# EAGLE design LEDStrip (EAGLE 7.4.0)
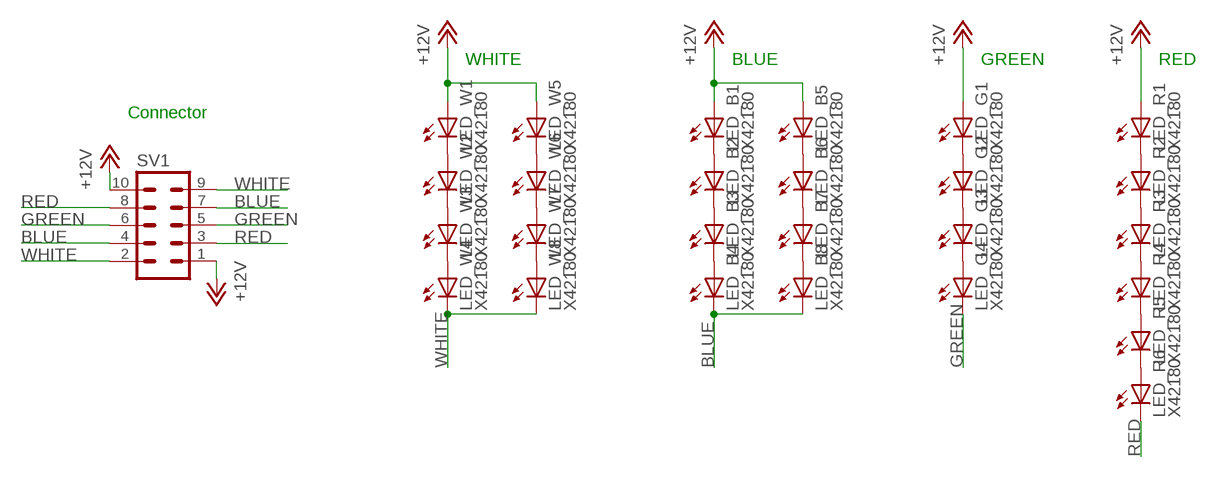
[diagram p0: schematic, sheet 1]

## Parts
LED_B1  X42180  [Z-POWER-LED-DOME-TYPE]
LED_B2  X42180  [Z-POWER-LED-DOME-TYPE]
LED_B3  X42180  [Z-POWER-LED-DOME-TYPE]
LED_B4  X42180  [Z-POWER-LED-DOME-TYPE]
LED_B5  X42180  [Z-POWER-LED-DOME-TYPE]
LED_B6  X42180  [Z-POWER-LED-DOME-TYPE]
LED_B7  X42180  [Z-POWER-LED-DOME-TYPE]
LED_B8  X42180  [Z-POWER-LED-DOME-TYPE]
LED_G1  X42180  [Z-POWER-LED-DOME-TYPE]
LED_G2  X42180  [Z-POWER-LED-DOME-TYPE]
LED_G3  X42180  [Z-POWER-LED-DOME-TYPE]
LED_G4  X42180  [Z-POWER-LED-DOME-TYPE]
LED_R1  X42180  [Z-POWER-LED-DOME-TYPE]
LED_R2  X42180  [Z-POWER-LED-DOME-TYPE]
LED_R3  X42180  [Z-POWER-LED-DOME-TYPE]
LED_R4  X42180  [Z-POWER-LED-DOME-TYPE]
LED_R5  X42180  [Z-POWER-LED-DOME-TYPE]
LED_R6  X42180  [Z-POWER-LED-DOME-TYPE]
LED_W1  X42180  [Z-POWER-LED-DOME-TYPE]
LED_W2  X42180  [Z-POWER-LED-DOME-TYPE]
LED_W3  X42180  [Z-POWER-LED-DOME-TYPE]
LED_W4  X42180  [Z-POWER-LED-DOME-TYPE]
LED_W5  X42180  [Z-POWER-LED-DOME-TYPE]
LED_W6  X42180  [Z-POWER-LED-DOME-TYPE]
LED_W7  X42180  [Z-POWER-LED-DOME-TYPE]
LED_W8  X42180  [Z-POWER-LED-DOME-TYPE]
SV1  MA05-2  [MA05-2]

## Nets
+12V: LED_B1.A LED_B5.A LED_G1.A LED_R1.A LED_W1.A LED_W5.A SV1.1 SV1.10
BLUE: LED_B4.C LED_B8.C SV1.4 SV1.7
GREEN: LED_G4.C SV1.5 SV1.6
N$1: LED_W1.C LED_W2.A
N$2: LED_W2.C LED_W3.A
N$3: LED_W3.C LED_W4.A
N$4: LED_W5.C LED_W6.A
N$5: LED_W6.C LED_W7.A
N$6: LED_W7.C LED_W8.A
N$7: LED_R4.C LED_R5.A
N$8: LED_B1.C LED_B2.A
N$9: LED_B2.C LED_B3.A
N$10: LED_B3.C LED_B4.A
N$11: LED_B5.C LED_B6.A
N$12: LED_B6.C LED_B7.A
N$13: LED_B7.C LED_B8.A
N$14: LED_G1.C LED_G2.A
N$15: LED_G2.C LED_G3.A
N$16: LED_G3.C LED_G4.A
N$20: LED_R1.C LED_R2.A
N$21: LED_R2.C LED_R3.A
N$22: LED_R3.C LED_R4.A
N$25: LED_R5.C LED_R6.A
RED: LED_R6.C SV1.3 SV1.8
WHITE: LED_W4.C LED_W8.C SV1.2 SV1.9

## Notes on the sheet
- WHITE | BLUE | GREEN | RED
- Connector

## Library data of the parts
LED_B1-LED_B8 LED_G1-LED_G4 LED_R1-LED_R6 LED_W1-LED_W8 = logan-custom:X42180: Z-Power LED P4 Series, Dome type Source: http://www.seoulsemicon.co.kr .. X42180.pdf
SV1 = con-lstb:MA05-2: PIN HEADER; OC_FARNELL: unknown; OC_NEWARK: unknown

## Board
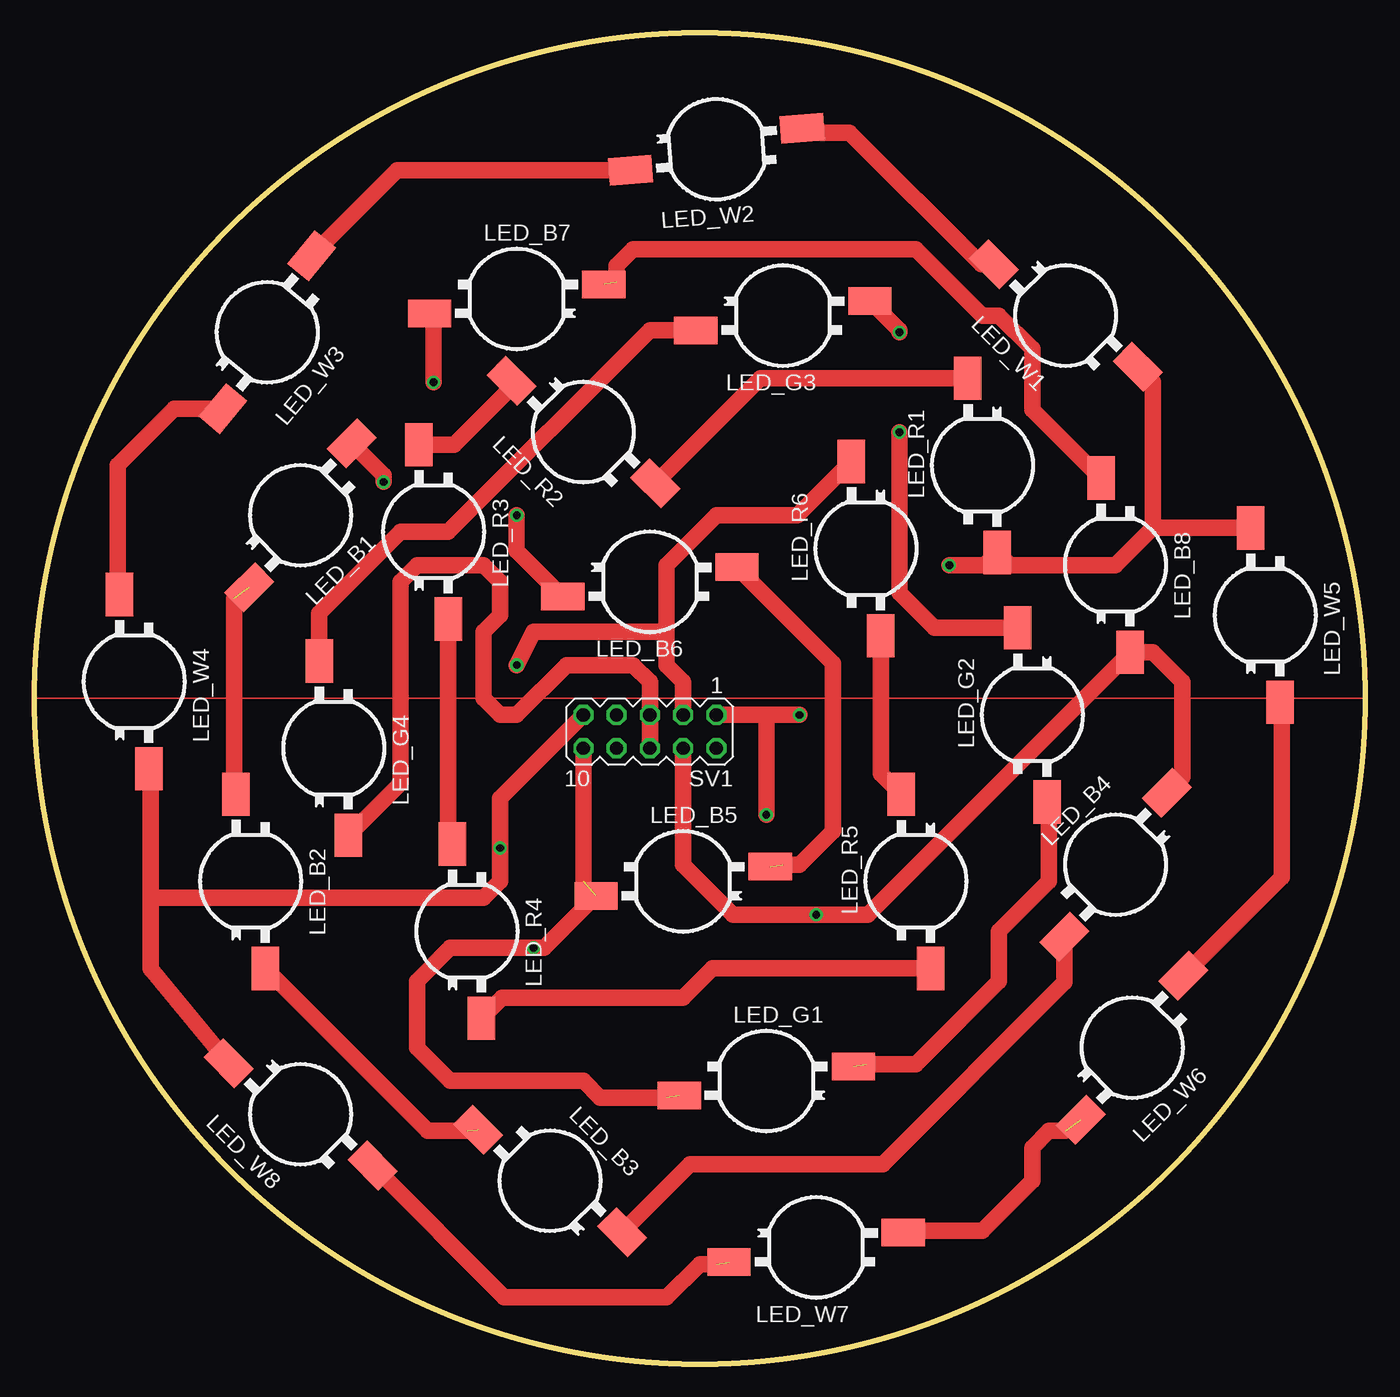
[diagram p1: board, top side]
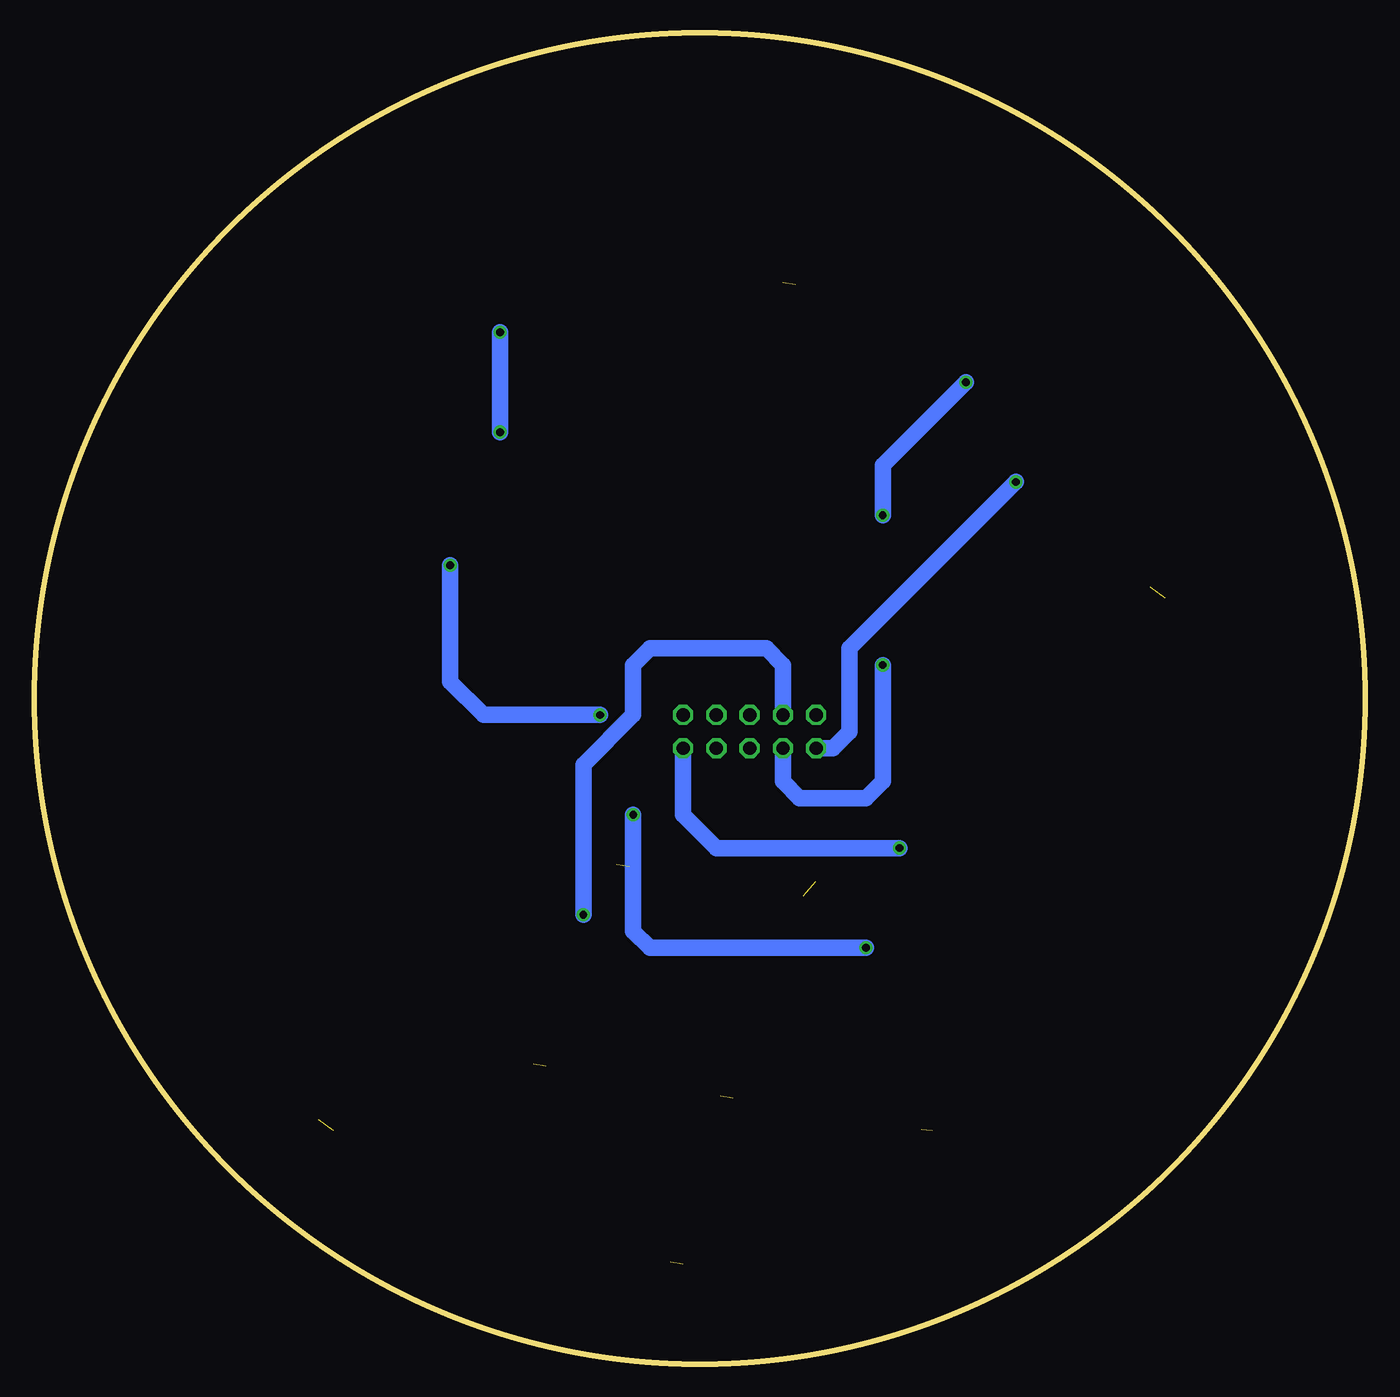
[diagram p2: board, bottom side, seen from below]

Size 101.6 x 101.6 mm. Coordinates in mm from the lower left corner, seen from the top.
Outline: circle at 50.8,50.8 radius 50.8
Copper layers (1*16): Top 0.035mm / dielectric 1.5mm / Bottom 0.035mm
Design rules "default": minimum track width 10mil, minimum drill 24mil, track to track 8mil, track to pad 8mil, pad to pad 8mil, via to via 8mil, smd to smd 8mil, copper to edge 40mil, drill to drill 8mil, minimum pad ring 10mil, minimum via ring 8mil, stop-mask expansion 4mil, vias tented up to drill 0mil, thermal gap 10mil

### Footprints (pad centres in the part's own frame; a part is rotated, then mirrored left to right if it is on the bottom)
Z-POWER-LED-DOME-TYPE = smd 3.3 x 2.1: A -6.65,-1.12; C 6.65,1.12
MA05-2 = drill 1.016 octagon: 1 -5.08,-1.27; 2 -5.08,1.27; 3 -2.54,-1.27; 4 -2.54,1.27; 5 0,-1.27; 6 0,1.27; 7 2.54,-1.27; 8 2.54,1.27; 9 5.08,-1.27; 10 5.08,1.27

### Placement (x,y rotation side)
LED_B1  20.32,64.77 225 top
LED_B2  16.51,36.83 270 top
LED_B3  39.37,13.97 315 top
LED_B4  82.55,38.1 45 top
LED_B5  49.53,36.83 0 top
LED_B6  46.99,59.69 180 top
LED_B7  36.83,81.28 0 top
LED_B8  82.55,60.96 270 top
LED_G1  55.88,21.59 0 top
LED_G2  76.2,49.53 90 top
LED_G3  57.15,80.01 180 top
LED_G4  22.86,46.99 270 top
LED_R1  72.39,68.58 90 top
LED_R2  41.91,71.12 135 top
LED_R3  30.48,63.5 270 top
LED_R4  33.02,33.02 270 top
LED_R5  67.31,36.83 90 top
LED_R6  63.5,62.23 90 top
LED_W1  78.74,80.01 135 top
LED_W2  52.07,92.71 184.2 top
LED_W3  17.78,78.74 230.3 top
LED_W4  7.62,52.07 270 top
LED_W5  93.98,57.15 270 top
LED_W6  83.82,24.13 225 top
LED_W7  59.69,8.89 180 top
LED_W8  20.32,19.05 135 top
SV1  46.99,48.26 180 top

### Tracks (layer width: path | path; a pad name or v marks a point on that pad's centre or on a via)
+12V  (via drill 0.6)  (2 unrouted)
  Top 1.27: LED_B5.A 38.92,31.75 v38.1,31.75 31.75,31.75 29.21,29.21 29.21,24.13 31.75,21.59 41.91,21.59 43.18,20.32 48.26,20.32 | 85.39,63.8 82.55,60.96 74.48,60.96 LED_R1.A 72.54,60.96 v69.85,60.96 | 85.39,63.8 LED_W5.A | LED_W1.A 85.39,74.94 85.39,63.8 | LED_B1.A 26.67,67.83 v26.67,67.31 | SV1.10 41.91,36.83 | 55.88,49.53 v58.42,49.53 | SV1.1 55.88,49.53 | 55.88,49.53 v55.88,41.91
  Bottom 1.27: v26.67,67.31 39.37,54.61 39.37,48.26 40.64,46.99 SV1.10 | v69.85,60.96 69.85,52.07 67.31,49.53 v58.42,49.53 | v55.88,41.91 55.88,33.02 54.61,31.75 v38.1,31.75
BLUE  (via drill 0.6)
  Top 1.27: LED_B4.C 87.63,44.76 87.63,52.07 85.39,54.31 LED_B8.C 63.65,34.29 v59.69,34.29 53.34,34.29 49.53,38.1 SV1.4
  Bottom 1.27: SV1.7 44.45,53.34 45.72,54.61 54.61,54.61 55.88,53.34 55.88,49.53 59.69,45.72 v59.69,34.29
GREEN
  Top 1.27: LED_G4.C 27.94,44.3 27.94,59.69 29.21,60.96 34.29,60.96 35.56,59.69 35.56,57.15 34.29,55.88 34.29,50.8 35.56,49.53 36.83,49.53 40.64,53.34 45.72,53.34 46.99,52.07 SV1.5 SV1.6
N$1
  Top 1.27: LED_W2.A 58.42,94.11 58.42,93.98 62.23,93.98 72.29,83.92 LED_W1.C
N$2
  Top 1.27: LED_W3.A 27.7,91.11 LED_W2.C
N$3
  Top 1.27: LED_W4.A 6.35,58.87 6.35,68.58 10.68,72.91 LED_W3.C
N$4
  Top 1.27: LED_W6.A 95.25,37.14 95.25,49.53 95.1,49.68 LED_W5.C
N$5  (1 unrouted)
  Top 1.27: LED_W7.A 66.49,10.16 72.39,10.16 76.2,13.97 76.2,16.51 77.47,17.78 78.74,17.78
N$6  (1 unrouted)
  Top 1.27: LED_W8.A 35.87,5.08 48.26,5.08 50.8,7.62 52.07,7.62
N$7
  Top 1.27: LED_R4.C 35.71,27.94 49.53,27.94 51.77,30.18 LED_R5.A
N$8  (1 unrouted)
  Top 1.27: LED_B2.A 15.24,43.63 15.24,58.42
N$9  (1 unrouted)
  Top 1.27: LED_B2.C 30.03,17.78 33.02,17.78
N$10
  Top 1.27: LED_B3.C 50.05,15.24 64.77,15.24 78.64,29.11 LED_B4.A
N$11  (1 unrouted)
  Top 1.27: LED_B6.A 60.96,53.49 60.96,40.64 58.42,38.1 57.15,38.1
N$12  (via drill 0.6)
  Top 1.27: LED_B7.A 30.48,79.86 v30.48,74.93 | LED_B6.C 36.83,62.08 v36.83,64.77
  Bottom 1.27: v30.48,74.93 36.83,68.58 v36.83,64.77
N$13  (1 unrouted)
  Top 1.27: LED_B8.A 76.2,72.84 76.2,77.47 73.66,80.01 72.39,80.01 67.31,85.09 45.72,85.09 44.45,83.82 44.45,82.55
N$14  (1 unrouted)
  Top 1.27: LED_G2.A 77.47,42.73 77.47,36.83 73.66,33.02 73.66,29.21 67.31,22.86 63.5,22.86
N$15  (via drill 0.6)
  Top 1.27: v66.04,71.12 66.04,58.87 68.73,56.18 LED_G2.C | LED_G3.A 66.04,78.89 v66.04,78.74
  Bottom 1.27: v66.04,71.12 v66.04,78.74
N$16
  Top 1.27: LED_G3.C 46.99,78.89 31.6,63.5 27.94,63.5 21.74,57.3 LED_G4.A
N$20
  Top 1.27: LED_R2.A 55.42,75.23 LED_R1.C
N$21
  Top 1.27: LED_R2.C 36.52,74.93 36.83,74.93 32.05,70.15 LED_R3.A
N$22
  Top 1.27: LED_R4.A 31.6,39.97 LED_R3.C
N$25
  Top 1.27: LED_R5.C 64.62,45.05 LED_R6.A
RED  (via drill 0.6)
  Top 1.27: LED_R6.C 58.27,64.77 52.07,64.77 48.26,60.96 48.26,55.88 | 48.26,55.88 48.26,53.34 49.53,52.07 SV1.3 | v36.83,53.34 38.1,55.88 48.26,55.88
  Bottom 1.27: SV1.8 44.45,44.45 43.18,43.18 38.1,43.18 36.83,44.45 v36.83,53.34
WHITE  (via drill 0.6)
  Top 1.27: LED_W4.C 8.89,45.27 8.89,35.56 | 8.89,35.56 8.89,30.17 LED_W8.C | SV1.9 35.56,43.18 v35.56,39.37 35.56,36.83 34.29,35.56 8.89,35.56
  Bottom 1.27: SV1.2 52.07,41.91 49.53,39.37 v35.56,39.37
(copper drawn outside any net)
  shapes: Top area x1